# Altium schematic sheet PicoZed.SchDoc: PicoZed Interface
size 431 x 254 mm; DrawnBy: Nathan Petersen; Engineer: Nathan Petersen; DocumentNumber: 2; Revision: v1.2; SheetNumber: 2; SheetTotal: 23
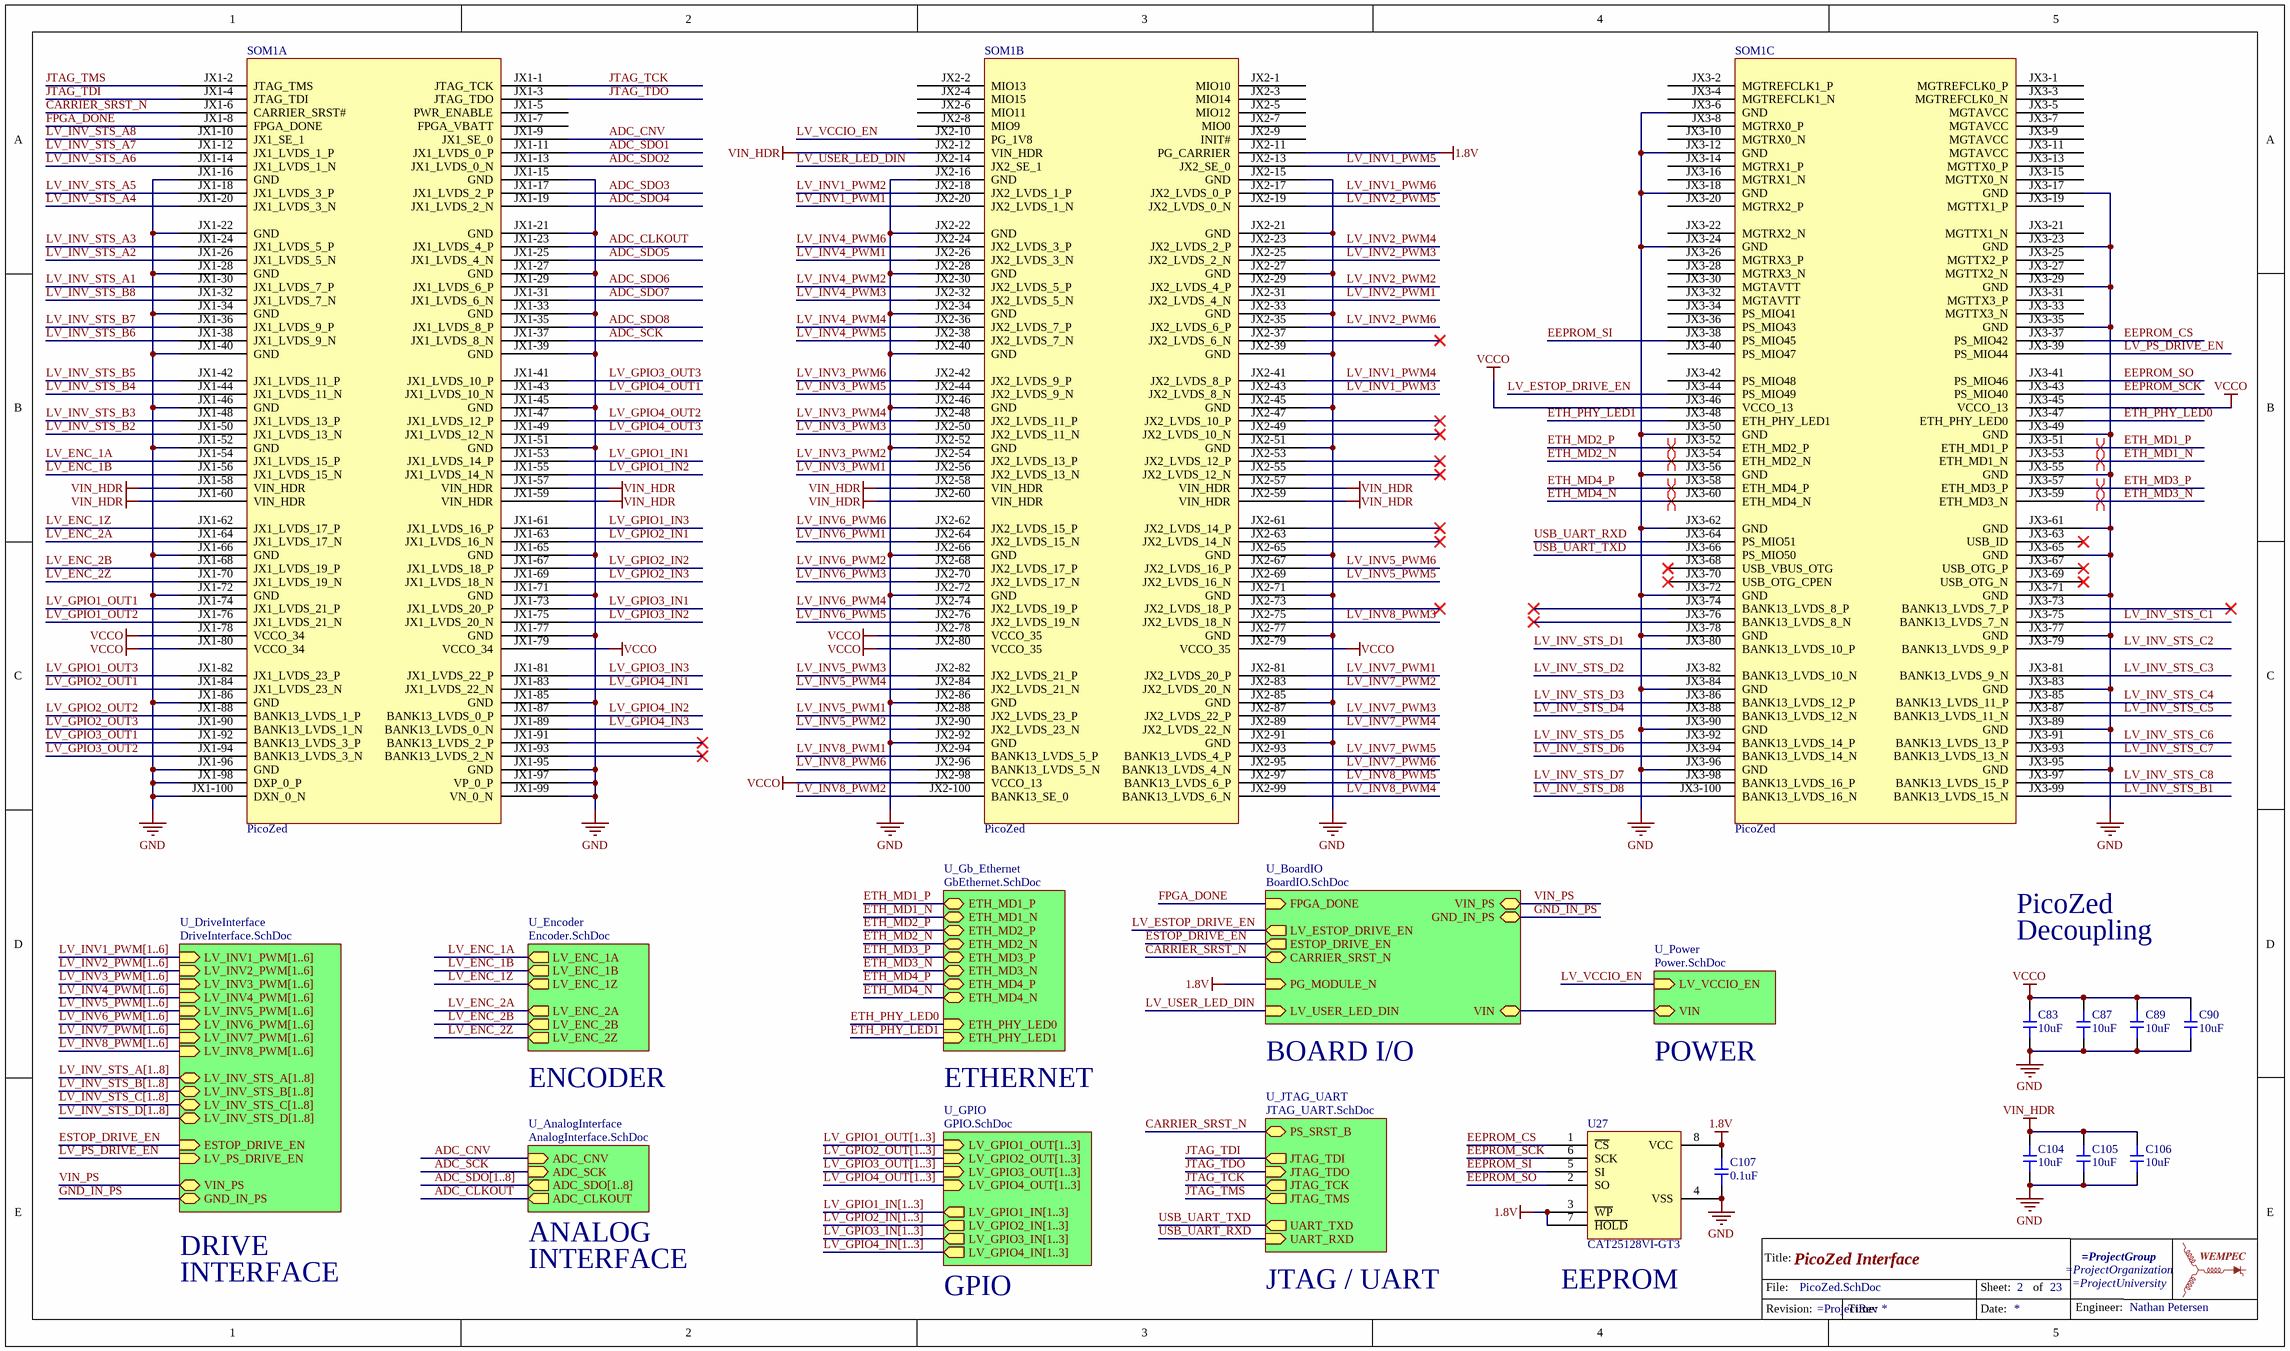
[diagram p0: PicoZed.SchDoc]

## Parts
*  TitleBlockWEMPEC  (value not drawn)  (graphical)
C83  value 10uF  [0603-CAP]  (hidden comment: Capacitor)
C87  value 10uF  [0603-CAP]  (hidden comment: Capacitor)
C89  value 10uF  [0603-CAP]  (hidden comment: Capacitor)
C90  value 10uF  [0603-CAP]  (hidden comment: Capacitor)
C104  value 10uF  [0603-CAP]  (hidden comment: Capacitor)
C105  value 10uF  [0603-CAP]  (hidden comment: Capacitor)
C106  value 10uF  [0603-CAP]  (hidden comment: Capacitor)
C107  value 0.1uF  [0603-CAP]  (hidden comment: Capacitor)
SOM1  PicoZed  [PicoZedSOM]  (parts A,B,C of 3)  (no BOM)
U27  CAT25128VI-GT3  [SOIC127P600X175-8N]

## Sub-sheets
U_AnalogInterface = AnalogInterface.SchDoc: ADC_SDO[1..8] (out), ADC_CNV (in), ADC_SCK (in), ADC_CLKOUT (out)
U_BoardIO = BoardIO.SchDoc: FPGA_DONE (in), ESTOP_DRIVE_EN (out), CARRIER_SRST_N (bidir), PG_MODULE_N (in), LV_USER_LED_DIN (in), LV_ESTOP_DRIVE_EN (out), GND_IN_PS (bidir), VIN_PS (bidir), VIN (bidir)
U_DriveInterface = DriveInterface.SchDoc: LV_INV2_PWM[1..6] (in), LV_INV3_PWM[1..6] (in), LV_INV4_PWM[1..6] (in), LV_INV5_PWM[1..6] (in), LV_INV6_PWM[1..6] (in), LV_INV7_PWM[1..6] (in), LV_INV8_PWM[1..6] (in), LV_INV1_PWM[1..6] (in), ESTOP_DRIVE_EN (in), LV_INV_STS_A[1..8] (bidir), LV_INV_STS_D[1..8] (bidir), LV_INV_STS_C[1..8] (bidir), LV_INV_STS_B[1..8] (bidir), LV_PS_DRIVE_EN (in), GND_IN_PS (bidir), VIN_PS (bidir)
U_Encoder = Encoder.SchDoc: LV_ENC_1A (out), LV_ENC_1B (out), LV_ENC_1Z (out), LV_ENC_2A (out), LV_ENC_2B (out), LV_ENC_2Z (out)
U_Gb_Ethernet = GbEthernet.SchDoc: ETH_MD1_P (bidir), ETH_MD1_N (bidir), ETH_MD2_P (bidir), ETH_MD2_N (bidir), ETH_MD3_P (bidir), ETH_MD3_N (bidir), ETH_MD4_P (bidir), ETH_MD4_N (bidir), ETH_PHY_LED0 (in), ETH_PHY_LED1 (in)
U_GPIO = GPIO.SchDoc: LV_GPIO4_OUT[1..3] (in), LV_GPIO3_OUT[1..3] (in), LV_GPIO1_OUT[1..3] (in), LV_GPIO3_IN[1..3] (out), LV_GPIO2_OUT[1..3] (in), LV_GPIO1_IN[1..3] (out), LV_GPIO2_IN[1..3] (out), LV_GPIO4_IN[1..3] (out)
U_JTAG_UART = JTAG_UART.SchDoc: JTAG_TMS (out), UART_TXD (out), PS_SRST_B (bidir), UART_RXD (in), JTAG_TDI (out), JTAG_TCK (out), JTAG_TDO (in)
U_Power = Power.SchDoc: VIN (bidir), LV_VCCIO_EN (in)

## Nets
1.8V: C107.2 SOM1.JX2-11(PG_CARRIER) U27.3(~{WP}) U27.7(~{HOLD}) U27.8(VCC) ; sheet U_BoardIO/PG_MODULE_N
GND: C83.1 C87.1 C89.1 C90.1 C104.1 C105.1 C106.1 C107.1 SOM1.JX1-15(GND) SOM1.JX1-16(GND) SOM1.JX1-21(GND) SOM1.JX1-22(GND) SOM1.JX1-27(GND) SOM1.JX1-28(GND) SOM1.JX1-33(GND) SOM1.JX1-34(GND) SOM1.JX1-39(GND) SOM1.JX1-40(GND) SOM1.JX1-45(GND) SOM1.JX1-46(GND) SOM1.JX1-51(GND) SOM1.JX1-52(GND) SOM1.JX1-65(GND) SOM1.JX1-66(GND) SOM1.JX1-71(GND) SOM1.JX1-72(GND) SOM1.JX1-77(GND) SOM1.JX1-85(GND) SOM1.JX1-86(GND) SOM1.JX1-95(GND) SOM1.JX1-96(GND) SOM1.JX1-97(VP_0_P) SOM1.JX1-98(DXP_0_P) SOM1.JX1-99(VN_0_N) SOM1.JX1-100(DXN_0_N) SOM1.JX2-15(GND) SOM1.JX2-16(GND) SOM1.JX2-21(GND) SOM1.JX2-22(GND) SOM1.JX2-27(GND) SOM1.JX2-28(GND) SOM1.JX2-33(GND) SOM1.JX2-34(GND) SOM1.JX2-39(GND) SOM1.JX2-40(GND) SOM1.JX2-45(GND) SOM1.JX2-46(GND) SOM1.JX2-51(GND) SOM1.JX2-52(GND) SOM1.JX2-65(GND) SOM1.JX2-66(GND) SOM1.JX2-71(GND) SOM1.JX2-72(GND) SOM1.JX2-77(GND) SOM1.JX2-85(GND) SOM1.JX2-86(GND) SOM1.JX2-91(GND) SOM1.JX2-92(GND) SOM1.JX3-6(GND) SOM1.JX3-12(GND) SOM1.JX3-17(GND) SOM1.JX3-18(GND) SOM1.JX3-23(GND) SOM1.JX3-24(GND) SOM1.JX3-29(GND) SOM1.JX3-35(GND) SOM1.JX3-49(GND) SOM1.JX3-50(GND) SOM1.JX3-55(GND) SOM1.JX3-56(GND) SOM1.JX3-61(GND) SOM1.JX3-62(GND) SOM1.JX3-65(GND) SOM1.JX3-71(GND) SOM1.JX3-72(GND) SOM1.JX3-77(GND) SOM1.JX3-78(GND) SOM1.JX3-83(GND) SOM1.JX3-84(GND) SOM1.JX3-89(GND) SOM1.JX3-90(GND) SOM1.JX3-95(GND) SOM1.JX3-96(GND) U27.4(VSS)
VCCO: C83.2 C87.2 C89.2 C90.2 SOM1.JX1-78(VCCO_34) SOM1.JX1-79(VCCO_34) SOM1.JX1-80(VCCO_34) SOM1.JX2-78(VCCO_35) SOM1.JX2-79(VCCO_35) SOM1.JX2-80(VCCO_35) SOM1.JX2-98(VCCO_13) SOM1.JX3-45(VCCO_13) SOM1.JX3-46(VCCO_13)
VIN_HDR: C104.2 C105.2 C106.2 SOM1.JX1-57(VIN_HDR) SOM1.JX1-58(VIN_HDR) SOM1.JX1-59(VIN_HDR) SOM1.JX1-60(VIN_HDR) SOM1.JX2-12(VIN_HDR) SOM1.JX2-57(VIN_HDR) SOM1.JX2-58(VIN_HDR) SOM1.JX2-59(VIN_HDR) SOM1.JX2-60(VIN_HDR)
ADC_CLKOUT: SOM1.JX1-23(JX1_LVDS_4_P) ; sheet U_AnalogInterface/ADC_CLKOUT
ADC_CNV: SOM1.JX1-9(JX1_SE_0) ; sheet U_AnalogInterface/ADC_CNV
ADC_SCK: SOM1.JX1-37(JX1_LVDS_8_N) ; sheet U_AnalogInterface/ADC_SCK
ADC_SDO1: SOM1.JX1-11(JX1_LVDS_0_P)
ADC_SDO2: SOM1.JX1-13(JX1_LVDS_0_N)
ADC_SDO3: SOM1.JX1-17(JX1_LVDS_2_P)
ADC_SDO4: SOM1.JX1-19(JX1_LVDS_2_N)
ADC_SDO5: SOM1.JX1-25(JX1_LVDS_4_N)
ADC_SDO6: SOM1.JX1-29(JX1_LVDS_6_P)
ADC_SDO7: SOM1.JX1-31(JX1_LVDS_6_N)
ADC_SDO8: SOM1.JX1-35(JX1_LVDS_8_P)
CARRIER_SRST_N: SOM1.JX1-6(CARRIER_SRST#) ; sheet U_BoardIO/CARRIER_SRST_N, sheet U_JTAG_UART/PS_SRST_B
EEPROM_CS: SOM1.JX3-37(PS_MIO42) U27.1(~{CS})
EEPROM_SCK: SOM1.JX3-43(PS_MIO40) U27.6(SCK)
EEPROM_SI: SOM1.JX3-38(PS_MIO45) U27.5(SI)
EEPROM_SO: SOM1.JX3-41(PS_MIO46) U27.2(SO)
ESTOP_DRIVE_EN: sheet U_DriveInterface/ESTOP_DRIVE_EN, sheet U_BoardIO/ESTOP_DRIVE_EN
ETH_MD1_N: SOM1.JX3-53(ETH_MD1_N) ; sheet U_Gb_Ethernet/ETH_MD1_N
ETH_MD1_P: SOM1.JX3-51(ETH_MD1_P) ; sheet U_Gb_Ethernet/ETH_MD1_P
ETH_MD2_N: SOM1.JX3-54(ETH_MD2_N) ; sheet U_Gb_Ethernet/ETH_MD2_N
ETH_MD2_P: SOM1.JX3-52(ETH_MD2_P) ; sheet U_Gb_Ethernet/ETH_MD2_P
ETH_MD3_N: SOM1.JX3-59(ETH_MD3_N) ; sheet U_Gb_Ethernet/ETH_MD3_N
ETH_MD3_P: SOM1.JX3-57(ETH_MD3_P) ; sheet U_Gb_Ethernet/ETH_MD3_P
ETH_MD4_N: SOM1.JX3-60(ETH_MD4_N) ; sheet U_Gb_Ethernet/ETH_MD4_N
ETH_MD4_P: SOM1.JX3-58(ETH_MD4_P) ; sheet U_Gb_Ethernet/ETH_MD4_P
ETH_PHY_LED0: SOM1.JX3-47(ETH_PHY_LED0) ; sheet U_Gb_Ethernet/ETH_PHY_LED0
ETH_PHY_LED1: SOM1.JX3-48(ETH_PHY_LED1) ; sheet U_Gb_Ethernet/ETH_PHY_LED1
FPGA_DONE: SOM1.JX1-8(FPGA_DONE) ; sheet U_BoardIO/FPGA_DONE
GND_IN_PS: sheet U_DriveInterface/GND_IN_PS, sheet U_BoardIO/GND_IN_PS
JTAG_TCK: SOM1.JX1-1(JTAG_TCK) ; sheet U_JTAG_UART/JTAG_TCK
JTAG_TDI: SOM1.JX1-4(JTAG_TDI) ; sheet U_JTAG_UART/JTAG_TDI
JTAG_TDO: SOM1.JX1-3(JTAG_TDO) ; sheet U_JTAG_UART/JTAG_TDO
JTAG_TMS: SOM1.JX1-2(JTAG_TMS) ; sheet U_JTAG_UART/JTAG_TMS
LV_ENC_1A: SOM1.JX1-54(JX1_LVDS_15_P) ; sheet U_Encoder/LV_ENC_1A
LV_ENC_1B: SOM1.JX1-56(JX1_LVDS_15_N) ; sheet U_Encoder/LV_ENC_1B
LV_ENC_1Z: SOM1.JX1-62(JX1_LVDS_17_P) ; sheet U_Encoder/LV_ENC_1Z
LV_ENC_2A: SOM1.JX1-64(JX1_LVDS_17_N) ; sheet U_Encoder/LV_ENC_2A
LV_ENC_2B: SOM1.JX1-68(JX1_LVDS_19_P) ; sheet U_Encoder/LV_ENC_2B
LV_ENC_2Z: SOM1.JX1-70(JX1_LVDS_19_N) ; sheet U_Encoder/LV_ENC_2Z
LV_ESTOP_DRIVE_EN: SOM1.JX3-44(PS_MIO49) ; sheet U_BoardIO/LV_ESTOP_DRIVE_EN
LV_GPIO1_IN1: SOM1.JX1-53(JX1_LVDS_14_P)
LV_GPIO1_IN2: SOM1.JX1-55(JX1_LVDS_14_N)
LV_GPIO1_IN3: SOM1.JX1-61(JX1_LVDS_16_P)
LV_GPIO1_OUT1: SOM1.JX1-74(JX1_LVDS_21_P)
LV_GPIO1_OUT2: SOM1.JX1-76(JX1_LVDS_21_N)
LV_GPIO1_OUT3: SOM1.JX1-82(JX1_LVDS_23_P)
LV_GPIO2_IN1: SOM1.JX1-63(JX1_LVDS_16_N)
LV_GPIO2_IN2: SOM1.JX1-67(JX1_LVDS_18_P)
LV_GPIO2_IN3: SOM1.JX1-69(JX1_LVDS_18_N)
LV_GPIO2_OUT1: SOM1.JX1-84(JX1_LVDS_23_N)
LV_GPIO2_OUT2: SOM1.JX1-88(BANK13_LVDS_1_P)
LV_GPIO2_OUT3: SOM1.JX1-90(BANK13_LVDS_1_N)
LV_GPIO3_IN1: SOM1.JX1-73(JX1_LVDS_20_P)
LV_GPIO3_IN2: SOM1.JX1-75(JX1_LVDS_20_N)
LV_GPIO3_IN3: SOM1.JX1-81(JX1_LVDS_22_P)
LV_GPIO3_OUT1: SOM1.JX1-92(BANK13_LVDS_3_P)
LV_GPIO3_OUT2: SOM1.JX1-94(BANK13_LVDS_3_N)
LV_GPIO3_OUT3: SOM1.JX1-41(JX1_LVDS_10_P)
LV_GPIO4_IN1: SOM1.JX1-83(JX1_LVDS_22_N)
LV_GPIO4_IN2: SOM1.JX1-87(BANK13_LVDS_0_P)
LV_GPIO4_IN3: SOM1.JX1-89(BANK13_LVDS_0_N)
LV_GPIO4_OUT1: SOM1.JX1-43(JX1_LVDS_10_N)
LV_GPIO4_OUT2: SOM1.JX1-47(JX1_LVDS_12_P)
LV_GPIO4_OUT3: SOM1.JX1-49(JX1_LVDS_12_N)
LV_INV1_PWM1: SOM1.JX2-20(JX2_LVDS_1_N)
LV_INV1_PWM2: SOM1.JX2-18(JX2_LVDS_1_P)
LV_INV1_PWM3: SOM1.JX2-43(JX2_LVDS_8_N)
LV_INV1_PWM4: SOM1.JX2-41(JX2_LVDS_8_P)
LV_INV1_PWM5: SOM1.JX2-13(JX2_SE_0)
LV_INV1_PWM6: SOM1.JX2-17(JX2_LVDS_0_P)
LV_INV2_PWM1: SOM1.JX2-31(JX2_LVDS_4_N)
LV_INV2_PWM2: SOM1.JX2-29(JX2_LVDS_4_P)
LV_INV2_PWM3: SOM1.JX2-25(JX2_LVDS_2_N)
LV_INV2_PWM4: SOM1.JX2-23(JX2_LVDS_2_P)
LV_INV2_PWM5: SOM1.JX2-19(JX2_LVDS_0_N)
LV_INV2_PWM6: SOM1.JX2-35(JX2_LVDS_6_P)
LV_INV3_PWM1: SOM1.JX2-56(JX2_LVDS_13_N)
LV_INV3_PWM2: SOM1.JX2-54(JX2_LVDS_13_P)
LV_INV3_PWM3: SOM1.JX2-50(JX2_LVDS_11_N)
LV_INV3_PWM4: SOM1.JX2-48(JX2_LVDS_11_P)
LV_INV3_PWM5: SOM1.JX2-44(JX2_LVDS_9_N)
LV_INV3_PWM6: SOM1.JX2-42(JX2_LVDS_9_P)
LV_INV4_PWM1: SOM1.JX2-26(JX2_LVDS_3_N)
LV_INV4_PWM2: SOM1.JX2-30(JX2_LVDS_5_P)
LV_INV4_PWM3: SOM1.JX2-32(JX2_LVDS_5_N)
LV_INV4_PWM4: SOM1.JX2-36(JX2_LVDS_7_P)
LV_INV4_PWM5: SOM1.JX2-38(JX2_LVDS_7_N)
LV_INV4_PWM6: SOM1.JX2-24(JX2_LVDS_3_P)
LV_INV5_PWM1: SOM1.JX2-88(JX2_LVDS_23_P)
LV_INV5_PWM2: SOM1.JX2-90(JX2_LVDS_23_N)
LV_INV5_PWM3: SOM1.JX2-82(JX2_LVDS_21_P)
LV_INV5_PWM4: SOM1.JX2-84(JX2_LVDS_21_N)
LV_INV5_PWM5: SOM1.JX2-69(JX2_LVDS_16_N)
LV_INV5_PWM6: SOM1.JX2-67(JX2_LVDS_16_P)
LV_INV6_PWM1: SOM1.JX2-64(JX2_LVDS_15_N)
LV_INV6_PWM2: SOM1.JX2-68(JX2_LVDS_17_P)
LV_INV6_PWM3: SOM1.JX2-70(JX2_LVDS_17_N)
LV_INV6_PWM4: SOM1.JX2-74(JX2_LVDS_19_P)
LV_INV6_PWM5: SOM1.JX2-76(JX2_LVDS_19_N)
LV_INV6_PWM6: SOM1.JX2-62(JX2_LVDS_15_P)
LV_INV7_PWM1: SOM1.JX2-81(JX2_LVDS_20_P)
LV_INV7_PWM2: SOM1.JX2-83(JX2_LVDS_20_N)
LV_INV7_PWM3: SOM1.JX2-87(JX2_LVDS_22_P)
LV_INV7_PWM4: SOM1.JX2-89(JX2_LVDS_22_N)
LV_INV7_PWM5: SOM1.JX2-93(BANK13_LVDS_4_P)
LV_INV7_PWM6: SOM1.JX2-95(BANK13_LVDS_4_N)
LV_INV8_PWM1: SOM1.JX2-94(BANK13_LVDS_5_P)
LV_INV8_PWM2: SOM1.JX2-100(BANK13_SE_0)
LV_INV8_PWM3: SOM1.JX2-75(JX2_LVDS_18_N)
LV_INV8_PWM4: SOM1.JX2-99(BANK13_LVDS_6_N)
LV_INV8_PWM5: SOM1.JX2-97(BANK13_LVDS_6_P)
LV_INV8_PWM6: SOM1.JX2-96(BANK13_LVDS_5_N)
LV_INV_STS_A1: SOM1.JX1-30(JX1_LVDS_7_P)
LV_INV_STS_A2: SOM1.JX1-26(JX1_LVDS_5_N)
LV_INV_STS_A3: SOM1.JX1-24(JX1_LVDS_5_P)
LV_INV_STS_A4: SOM1.JX1-20(JX1_LVDS_3_N)
LV_INV_STS_A5: SOM1.JX1-18(JX1_LVDS_3_P)
LV_INV_STS_A6: SOM1.JX1-14(JX1_LVDS_1_N)
LV_INV_STS_A7: SOM1.JX1-12(JX1_LVDS_1_P)
LV_INV_STS_A8: SOM1.JX1-10(JX1_SE_1)
LV_INV_STS_B1: SOM1.JX3-99(BANK13_LVDS_15_N)
LV_INV_STS_B2: SOM1.JX1-50(JX1_LVDS_13_N)
LV_INV_STS_B3: SOM1.JX1-48(JX1_LVDS_13_P)
LV_INV_STS_B4: SOM1.JX1-44(JX1_LVDS_11_N)
LV_INV_STS_B5: SOM1.JX1-42(JX1_LVDS_11_P)
LV_INV_STS_B6: SOM1.JX1-38(JX1_LVDS_9_N)
LV_INV_STS_B7: SOM1.JX1-36(JX1_LVDS_9_P)
LV_INV_STS_B8: SOM1.JX1-32(JX1_LVDS_7_N)
LV_INV_STS_C1: SOM1.JX3-75(BANK13_LVDS_7_N)
LV_INV_STS_C2: SOM1.JX3-79(BANK13_LVDS_9_P)
LV_INV_STS_C3: SOM1.JX3-81(BANK13_LVDS_9_N)
LV_INV_STS_C4: SOM1.JX3-85(BANK13_LVDS_11_P)
LV_INV_STS_C5: SOM1.JX3-87(BANK13_LVDS_11_N)
LV_INV_STS_C6: SOM1.JX3-91(BANK13_LVDS_13_P)
LV_INV_STS_C7: SOM1.JX3-93(BANK13_LVDS_13_N)
LV_INV_STS_C8: SOM1.JX3-97(BANK13_LVDS_15_P)
LV_INV_STS_D1: SOM1.JX3-80(BANK13_LVDS_10_P)
LV_INV_STS_D2: SOM1.JX3-82(BANK13_LVDS_10_N)
LV_INV_STS_D3: SOM1.JX3-86(BANK13_LVDS_12_P)
LV_INV_STS_D4: SOM1.JX3-88(BANK13_LVDS_12_N)
LV_INV_STS_D5: SOM1.JX3-92(BANK13_LVDS_14_P)
LV_INV_STS_D6: SOM1.JX3-94(BANK13_LVDS_14_N)
LV_INV_STS_D7: SOM1.JX3-98(BANK13_LVDS_16_P)
LV_INV_STS_D8: SOM1.JX3-100(BANK13_LVDS_16_N)
LV_PS_DRIVE_EN: SOM1.JX3-39(PS_MIO44) ; sheet U_DriveInterface/LV_PS_DRIVE_EN
LV_USER_LED_DIN: SOM1.JX2-14(JX2_SE_1) ; sheet U_BoardIO/LV_USER_LED_DIN
LV_VCCIO_EN: SOM1.JX2-10(PG_1V8) ; sheet U_Power/LV_VCCIO_EN
USB_UART_RXD: SOM1.JX3-64(PS_MIO51) ; sheet U_JTAG_UART/UART_RXD
USB_UART_TXD: SOM1.JX3-66(PS_MIO50) ; sheet U_JTAG_UART/UART_TXD
VIN_PS: sheet U_DriveInterface/VIN_PS, sheet U_BoardIO/VIN_PS
(unnamed): sheet U_BoardIO/VIN, sheet U_Power/VIN

Not connected (* = marked no-connect by the designer): SOM1 JX1-5(PWR_ENABLE) JX1-7(FPGA_VBATT) JX1-91(BANK13_LVDS_2_P)* JX1-93(BANK13_LVDS_2_N)* JX2-1(MIO10) JX2-2(MIO13) JX2-3(MIO14) JX2-4(MIO15) JX2-5(MIO12) JX2-6(MIO11) JX2-7(MIO0) JX2-8(MIO9) JX2-9(INIT#) JX2-37(JX2_LVDS_6_N)* JX2-47(JX2_LVDS_10_P)* JX2-49(JX2_LVDS_10_N)* JX2-53(JX2_LVDS_12_P)* JX2-55(JX2_LVDS_12_N)* JX2-61(JX2_LVDS_14_P)* JX2-63(JX2_LVDS_14_N)* JX2-73(JX2_LVDS_18_P)* JX3-1(MGTREFCLK0_P) JX3-2(MGTREFCLK1_P) JX3-3(MGTREFCLK0_N) JX3-4(MGTREFCLK1_N) JX3-5(MGTAVCC) JX3-7(MGTAVCC) JX3-8(MGTRX0_P) JX3-9(MGTAVCC) JX3-10(MGTRX0_N) JX3-11(MGTAVCC) JX3-13(MGTTX0_P) JX3-14(MGTRX1_P) JX3-15(MGTTX0_N) JX3-16(MGTRX1_N) JX3-19(MGTTX1_P) JX3-20(MGTRX2_P) JX3-21(MGTTX1_N) JX3-22(MGTRX2_N) JX3-25(MGTTX2_P) JX3-26(MGTRX3_P) JX3-27(MGTTX2_N) JX3-28(MGTRX3_N) JX3-30(MGTAVTT) JX3-31(MGTTX3_P) JX3-32(MGTAVTT) JX3-33(MGTTX3_N) JX3-34(PS_MIO41) JX3-36(PS_MIO43) JX3-40(PS_MIO47) JX3-42(PS_MIO48) JX3-63(USB_ID)* JX3-67(USB_OTG_P)* JX3-68(USB_VBUS_OTG)* JX3-69(USB_OTG_N)* JX3-70(USB_OTG_CPEN)* JX3-73(BANK13_LVDS_7_P)* JX3-74(BANK13_LVDS_8_P)* JX3-76(BANK13_LVDS_8_N)*

## Buses and harness runs
bus ADC_SDO[1..8] = sheet U_AnalogInterface/ADC_SDO[1..8]
bus LV_GPIO1_IN[1..3] = sheet U_GPIO/LV_GPIO1_IN[1..3]
bus LV_GPIO1_OUT[1..3] = sheet U_GPIO/LV_GPIO1_OUT[1..3]
bus LV_GPIO2_IN[1..3] = sheet U_GPIO/LV_GPIO2_IN[1..3]
bus LV_GPIO2_OUT[1..3] = sheet U_GPIO/LV_GPIO2_OUT[1..3]
bus LV_GPIO3_IN[1..3] = sheet U_GPIO/LV_GPIO3_IN[1..3]
bus LV_GPIO3_OUT[1..3] = sheet U_GPIO/LV_GPIO3_OUT[1..3]
bus LV_GPIO4_IN[1..3] = sheet U_GPIO/LV_GPIO4_IN[1..3]
bus LV_GPIO4_OUT[1..3] = sheet U_GPIO/LV_GPIO4_OUT[1..3]
bus LV_INV1_PWM[1..6] = sheet U_DriveInterface/LV_INV1_PWM[1..6]
bus LV_INV2_PWM[1..6] = sheet U_DriveInterface/LV_INV2_PWM[1..6]
bus LV_INV3_PWM[1..6] = sheet U_DriveInterface/LV_INV3_PWM[1..6]
bus LV_INV4_PWM[1..6] = sheet U_DriveInterface/LV_INV4_PWM[1..6]
bus LV_INV5_PWM[1..6] = sheet U_DriveInterface/LV_INV5_PWM[1..6]
bus LV_INV6_PWM[1..6] = sheet U_DriveInterface/LV_INV6_PWM[1..6]
bus LV_INV7_PWM[1..6] = sheet U_DriveInterface/LV_INV7_PWM[1..6]
bus LV_INV8_PWM[1..6] = sheet U_DriveInterface/LV_INV8_PWM[1..6]
bus LV_INV_STS_A[1..8] = sheet U_DriveInterface/LV_INV_STS_A[1..8]
bus LV_INV_STS_B[1..8] = sheet U_DriveInterface/LV_INV_STS_B[1..8]
bus LV_INV_STS_C[1..8] = sheet U_DriveInterface/LV_INV_STS_C[1..8]
bus LV_INV_STS_D[1..8] = sheet U_DriveInterface/LV_INV_STS_D[1..8]

## Layout directives
differential pair: ETH_MD1_N, ETH_MD1_P, ETH_MD2_N, ETH_MD2_P, ETH_MD3_N, ETH_MD3_P, ETH_MD4_N, ETH_MD4_P

## Notes on the sheet
- PicoZed
- Decoupling
- ENCODER
- ETHERNET
- BOARD I/O
- POWER
- DRIVE
- ANALOG
- INTERFACE
- GPIO
- JTAG / UART
- (near U27) EEPROM
- Title:
- File:
- Sheet:
- of
- Revision:
- Time:
- Date:
- Engineer:
- (in symbol TitleBlockWEMPEC) Title:; File:; Sheet:; of; Engineer:; Revision:; Time:; Date:

## Library data of the parts
SOM1 = PicoZed_SOM: PicoZed SOM Carrier Footprint
U27 = CAT25128VI-GT3: IC EEPROM 128K SPI 20MHZ 8SOIC; Supplier 1: Digi-Key; Supplier Part Number 1: CAT25128VI-GT3OSCT-ND
C83 C87 C89 C90 C104-C107 = Capacitor: Supplier 1: Digi-Key
  C83 C87 C89 C90 C104-C106: Supplier Part Number 1: 1276-1119-6-ND
  C107: Supplier Part Number 1: 1276-1012-6-ND